# Altium schematic sheet 6-Ethernet.SchDoc
size 420 x 297 mm; CompanyName: Microchip Technology Inc.; Organization: Microchip Technology; Address1: 2355 West Chandler Blvd.; Address2: Chandler, AZ  85224; Address4: USA; SheetTitle: **; Time: Time
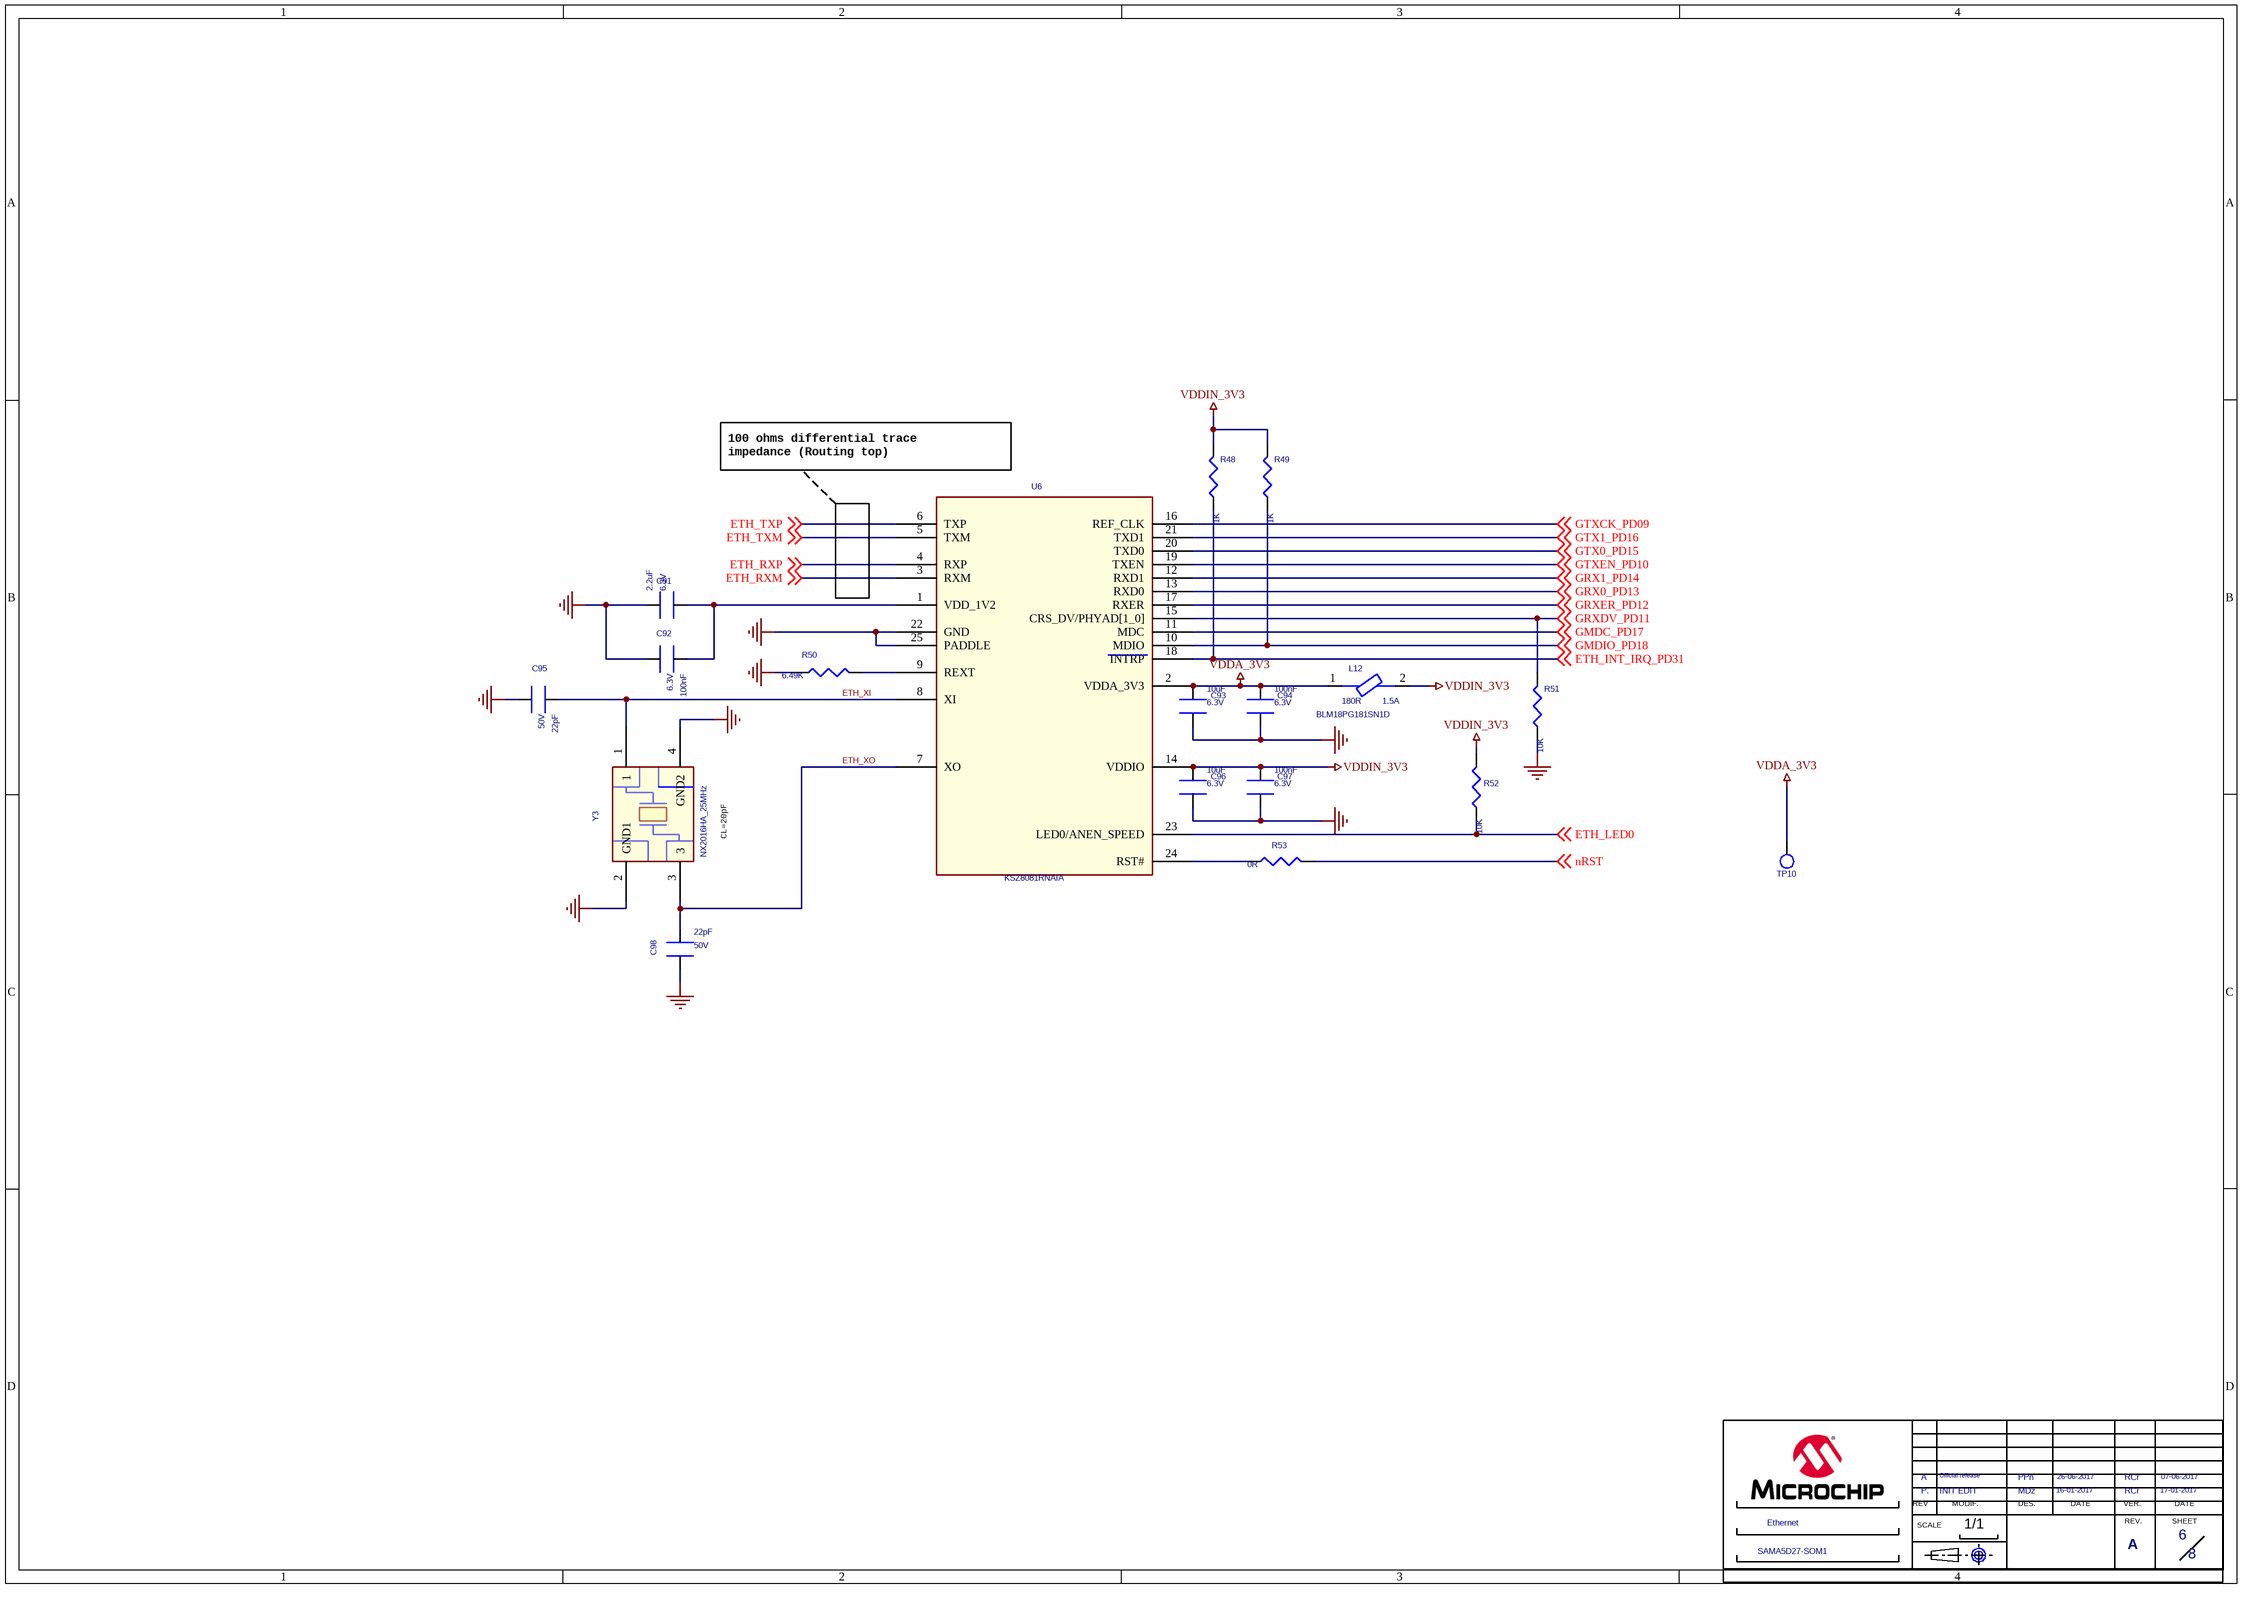
[diagram p0: 6-Ethernet.SchDoc]

## Parts
*  MODIF.A: INIT EDIT  SHEET NAME 2: Ethernet  SHEET NAME 1: SAMA5D27-SOM1  REV B: A  VERIF B: RCr  VERIF DATE A: 17-01-2017  VERIF DATE B: 07-06-2017  Page Count: 8  Page Number: 6  DATE A: 16-01-2017  DATE B: 26-06-2017  DES A: MDz  DES B: PPn  MODIF.B: Official release  REV A: P.  (hidden comment: CARTOUCHE MICROCHIP)  (graphical)
?  (no value)  (graphical)
C91  VALEUR: 2.2uF  TENSION: 6.3V  [C0402]  (hidden comment: xpF x% xV)
C92  VALEUR: 100nF  TENSION: 6.3V  [C0201]  (hidden comment: xpF x% xV)
C93  TENSION: 6.3V  VALEUR: 10uF  [C0402]  (hidden comment: xpF x% xV)
C94  VALEUR: 100nF  TENSION: 6.3V  [C0201]  (hidden comment: xpF x% xV)
C95  TENSION: 50V  VALEUR: 22pF  [C0201]  (hidden comment: xpF x% xV)
C96  TENSION: 6.3V  VALEUR: 10uF  [C0402]  (hidden comment: xpF x% xV)
C97  VALEUR: 100nF  TENSION: 6.3V  [C0201]  (hidden comment: xpF x% xV)
C98  TENSION: 50V  VALEUR: 22pF  [C0201]  (hidden comment: xpF x% xV)
L12  180R  COURANT: 1.5A  [L0603_02]
R48  VALEUR: 1K  [R0201]  (hidden comment: xR x% xW)
R49  VALEUR: 1K  [R0201]  (hidden comment: xR x% xW)
R50  VALEUR: 6.49K  [R0402]  (hidden comment: xR x% xW)
R51  VALEUR: 10K  [R0201]  (hidden comment: xR x% xW)
R52  VALEUR: 10K  [R0201]  (hidden comment: xR x% xW)
R53  VALEUR: 0R  [R0201]  (hidden comment: xR x% xW)
TP10  TP  [tp-cmsrond-1mm_02]  (value not drawn)
U6  KSZ8081RNAIA  [QFN24_01]
Y3  NX2016HA_25MHz  [QUARTZ-NX2016HA_01]

## Nets
GND: C91.2 C92.1 C93.1 C94.1 C95.1 C96.1 C97.1 C98.1 R50.1 R51.1 U6.22(GND) U6.25(PADDLE) Y3.2(GND1) Y3.4(GND2)
VDDA_3V3: C93.2 C94.2 L12.1 TP10.1 U6.2(VDDA_3V3)
VDDIN_3V3: C96.2 C97.2 L12.2 R48.2 R49.2 R52.2 U6.14(VDDIO)
ETH_INT_IRQ_PD31: R48.1 U6.18(INTRP) ; off-sheet ETH_INT_IRQ_PD31
ETH_LED0: R52.1 U6.23(LED0/ANEN_SPEED) ; off-sheet ETH_LED0
ETH_RXM: U6.3(RXM) ; off-sheet ETH_RXM
ETH_RXP: U6.4(RXP) ; off-sheet ETH_RXP
ETH_TXM: U6.5(TXM) ; off-sheet ETH_TXM
ETH_TXP: U6.6(TXP) ; off-sheet ETH_TXP
ETH_XI: C95.2 U6.8(XI) Y3.1
ETH_XO: C98.2 U6.7(XO) Y3.3
GMDC_PD17: U6.11(MDC) ; off-sheet GMDC_PD17
GMDIO_PD18: R49.1 U6.10(MDIO) ; off-sheet GMDIO_PD18
GRX0_PD13: U6.13(RXD0) ; off-sheet GRX0_PD13
GRX1_PD14: U6.12(RXD1) ; off-sheet GRX1_PD14
GRXDV_PD11: R51.2 U6.15(CRS_DV/PHYAD[1_0]) ; off-sheet GRXDV_PD11
GRXER_PD12: U6.17(RXER) ; off-sheet GRXER_PD12
GTX0_PD15: U6.20(TXD0) ; off-sheet GTX0_PD15
GTX1_PD16: U6.21(TXD1) ; off-sheet GTX1_PD16
GTXCK_PD09: U6.16(REF_CLK) ; off-sheet GTXCK_PD09
GTXEN_PD10: U6.19(TXEN) ; off-sheet GTXEN_PD10
nRST: R53.2 ; off-sheet nRST
NetC91_1: C91.1 C92.2 U6.1(VDD_1V2)
NetR50_2: R50.2 U6.9(REXT)
NetR53_1: R53.1 U6.24(RST#)

## Notes on the sheet
- 100 ohms differential trace
  impedance (Routing top)
- (near Y3) CL=20pF
- Drawn By:
- Engineer:
- PartNumber:
- Project Title
- Sheet Title
- Size
- B
- Revision:
- Sch #:
- Date:
- Sheet
- Designed with
- Altium.com <http://go.altium.com/MicrochipLandingPage_Evaluation.html>
- File:
- (in symbol CARTOUCHE MICROCHIP) REV; MODIF.; DES.; DATE; VER.; SCALE; REV.; SHEET; 1/1

## Library data of the parts
* = CARTOUCHE MICROCHIP: REV D: D; REV C: C; REV F: F; REV E: E; VERIF F: XXX; VERIF DATE F: XX-XXX-XX; MODIF.C: RevC; MODIF.D: RevD; MODIF.E: RevE; MODIF.F: RevF; VERIF E: XXX; VERIF D: XXX; VERIF C: RCr; VERIF A: RCr; VERIF DATE E: XX-XXX-XX; VERIF DATE D: XX-XXX-XX; VERIF DATE C: 07-06-2017; REV: A; FT: ?; Page Size: A; Page Create Date: june 19, 2004; DATE C: 07-06-2017; DATE D: XX-XXX-XX; DATE E: XX-XXX-XX; DATE F: XX-XXX-XX; DES E: XXX; DES F: XXX; DES C: XXX; DES D: XXX
? = Title Block B
C91 = C0402-2.2uF-X5R-6.3V: DIELECTRIQUE: X5R; BOITIER: 0402; DESIGNATION: Condensateur CMS céramique; TOLERENCE: ?%; HAUTEUR: xmm; COURANT: xA; TEMPERATURE: 40°C/+85°C
C92 C94 C97 = C0201-100nF-X5R-6.3V: DIELECTRIQUE: X5R; BOITIER: 0201; DESIGNATION: Condensateur CMS céramique; TOLERENCE: ?%; HAUTEUR: xmm; COURANT: xA; TEMPERATURE: 40°C/+85°C
C93 C96 = C0402-10uF-X5R-6.3V: COURANT: xA; HAUTEUR: xmm; TOLERENCE: ?%; DESIGNATION: Condensateur CMS céramique; BOITIER: 0402; DIELECTRIQUE: X5R; TEMPERATURE: 40°C/+85°C
C95 C98 = C0201-22pF-C0G-50V: COURANT: xA; HAUTEUR: xmm; TOLERENCE: ?%; DESIGNATION: Condensateur CMS céramique; BOITIER: 0201; DIELECTRIQUE: C0G; TEMPERATURE: 40°C/+85°C
L12 = BLM18PG181SN1D: partnumber: MLZ1608N100L; TOLERANCE: 25%; FABRICANT: MURATA; type: ???; DESIGNTION: Ferrite CMS; Valeur: BLM18PG181SN1D; TEMPERATURE: -55°C/+125°C
R48 R49 = R0201-1K-5%: TENSION: xV; BOITIER: 0201; COURANT: xA; DESIGNATION: Resistance CMS; TOLERANCE: 5%; PUISSANCE: xW; TEMPERATURE: -40°C/+85°C
R50 = R0402-6.49K-1%: TOLERANCE: 1%; DESIGNATION: Resistance CMS; COURANT: xA; BOITIER: 0402; TENSION: xV; TEMPERATURE: -40°C/+85°C; PUISSANCE: xW
R51 R52 = R0201-10K-5%: TENSION: xV; BOITIER: 0201; COURANT: xA; DESIGNATION: Resistance CMS; TOLERANCE: 5%; PUISSANCE: xW; TEMPERATURE: -40°C/+85°C
R53 = R0201-0R: TENSION: xV; BOITIER: 0201; COURANT: xA; DESIGNATION: Resistance CMS; PUISSANCE: xW; TEMPERATURE: -40°C/+85°C; TOLERANCE: x%
TP10 = TP: DESIGNATION: POINT DE TEST
U6 = KSZ8081RNAIA: FABRICANT: MICREL; DESIGNATION: Ethernet; TEMPERATURE: -40°C/+85°C
Y3 = NX2016HA_25MHz: FREQUENCE: 25MHz; FABRICANT: NDK; DESIGNATION: Quartz 25MHz; TEMPERATURE: -40°C/+85°C